# Altium schematic sheet DSD_SDR_MainBoard_Simple.SchDoc
size A4; SheetNumber: 1; SheetTotal: 1; SPICEModelCacheQBMOYUVP: <root> / <DocumentId>QBMOYUVP</DocumentId> / <CacheFrame Number="0"> / <Model Name="0603_742792651_600ohm" Kind="CKT"> / <Text>******* / .subckt 0603_742792651_600ohm 1 2 / Rp 1 2 813 / Cp 1 2 0.617p / Rs 1 N3 0.2 / L1 N3 2 1.384u / .ends 0603_742792651_600ohm</Text> / </Model> / <Model Name="0603_885012206051_680nf" Kind="CKT"> / <Text>******* / .subckt 0603_885012206051_680nF 1 2 / Rser 1 3 0.00730097281816 / Lser 2 4 4.2920775E-10 / C1 3 4 0.00000068 / Rpar 3 4 700000000 / .ends 0603_885012206051_680nF</Text> / </Model> / </CacheFrame> / </root>
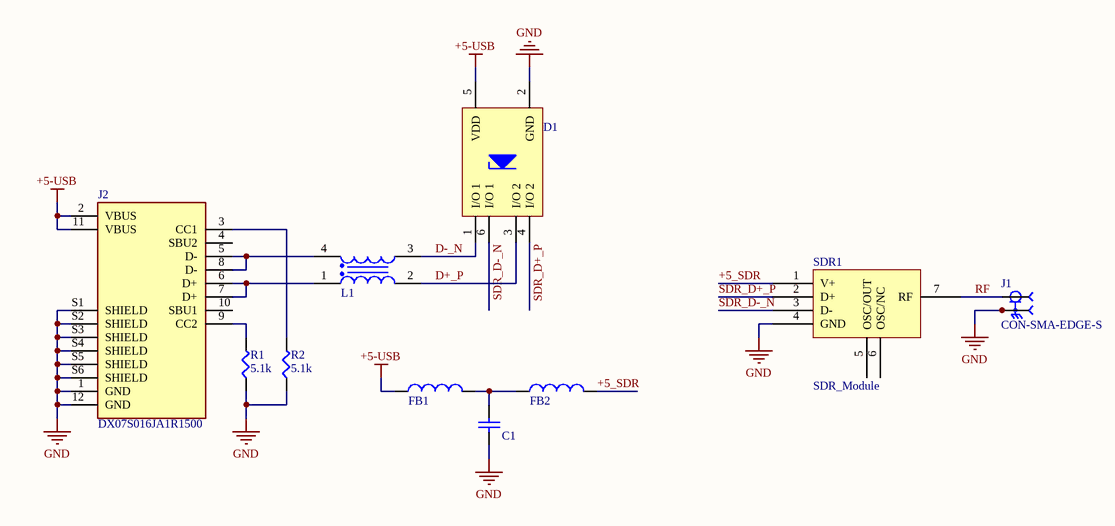
[diagram p0: DSD_SDR_MainBoard_Simple.SchDoc]

## Parts
C1  680nF  [WCAP-CSGP_0603_L1.6W0.8H0.8_Reflow]  (value not drawn)
D1  5V  [WE-TVS_SOT23-6L]  (value not drawn)
FB1  600Ohm  [WE-CBF_0603_L1.6W0.8H0.8_HC]  (value not drawn)
FB2  600Ohm  [WE-CBF_0603_L1.6W0.8H0.8_HC]  (value not drawn)
J1  CON-SMA-EDGE-S  [RFSOLUTIONS_CON-SMA-EDGE-S]
J2  DX07S016JA1R1500  [JAE_DX07S016JA1R1500]
L1  90Ohm  [WE-CNSW_1206]  (value not drawn)
R1  5.1k  [SMD-0603-RES]
R2  5.1k  [SMD-0603-RES]
SDR1  SDR_Module  [SDR]

## Nets
+5-USB: D1.5(VDD) FB1.1 J2.2(VBUS) J2.11(VBUS)
GND: C1.1 D1.2(GND) J1.G1 J1.G2 J1.G3 J1.G4 J2.1(GND) J2.12(GND) J2.S1(SHIELD) J2.S2(SHIELD) J2.S3(SHIELD) J2.S4(SHIELD) J2.S5(SHIELD) J2.S6(SHIELD) R1.1 R2.1 SDR1.4(GND)
+5_SDR: FB2.2 SDR1.1(V+)
D+_P: D1.3(I/O_2) L1.2
D-_N: D1.1(I/O_1) L1.3
RF: J1.1 SDR1.7(RF)
SDR_D+_P: D1.4(I/O_2) SDR1.2(D+)
SDR_D-_N: D1.6(I/O_1) SDR1.3(D-)
NetC1_2: C1.2 FB1.2 FB2.1
NetJ2_3: J2.3(CC1) R2.2
NetJ2_5: J2.5(D-) J2.8(D-) L1.4
NetJ2_6: J2.6(D+) J2.7(D+) L1.1
NetJ2_9: J2.9(CC2) R1.2

Not connected (* = marked no-connect by the designer): J2 4(SBU2) 10(SBU1); SDR1 5(OSC/OUT) 6(OSC/NC)

## Library data of the parts
C1 = 885012206051: WCAP-CSGP Multilayer Ceramic Chip Capacitor, General Purpose, size 0603, X7R, 680nF, 16VDC; Manufacturer: Wurth Elektronik; Case/Size Code: 0603; Capacitance Tolerance: +/-10%; Dissipation Factor: 10%; Insulation Resistance: 0.7GΩ; Rated Voltage (DC): 16V; Technical Reference: X7R0603684K016DFCT10000; Manufacturer Part Number: 885012206051; Category: Multilayer Ceramic Chip Capacitors; Match Code: WCAP-CSGP; ComponentLink1Description: Website Link; ComponentLink1URL: https://www.we-online.com/redexpert/article/885012206051?ad; ComponentLink2Description: Datasheet Link; ComponentLink2URL: https://www.we-online.com/redexpert/spec/885012206051?ad; Mount: Surface Mount; Operating Temperature Max: 125°C; Operating Temperature Min: -55°C; Packaging: Tape and Reel; Length: 1.6mm; Width: 0.8mm; Height: 0.8mm; Capacitance: 680nF; Ceramic Type: X7R
D1 = 82400102: WE-TVS TVS Diode – High Speed Series, SOT23-6L, 2+1 Channel, 5V, 2pF; Manufacturer: Wurth Elektronik; Channel ESD Clamping Voltage: 10V; Channel Reverse Leakage Current: 1µA; ESD Air Discharge Capability: 15kV; ESD Contact Discharge Capability: 8kV; Polarity: Unidirectional; (Reverse) Breakdown Voltage: 6V; (Reverse) Peak Pulse Current: 7A; ComponentLink1Description: Website Link; ComponentLink1URL: https://www.we-online.com/redexpert/article/82400102?ad; ComponentLink2Description: Datasheet Link; ComponentLink2URL: https://www.we-online.com/redexpert/spec/82400102?ad; Manufacturer Part Number: 82400102; Category: ESD Protection; Match Code: WE-TVS; Mount: Surface Mount; Operating Temperature Max: 125°C; Operating Temperature Min: -40°C; Packaging: Tape and Reel; Case/Size Code: SOT23-6L; Length: 2.9mm; Width: 2.8mm; Height: 1.45mm; Channel Input Capacitance: 2pF; Channel Operating Voltage: 5V; Number of Channels: 2+1
FB1 FB2 = 742792651: WE-CBF SMT EMI Suppression Ferrite Bead, size 0603, 600Ohm, 1A; Manufacturer: Wurth Elektronik; Case/Size Code: 0603; DC Resistance Max: 0.2Ohm; Impedance Max: 800Ohm; Impedance Max Test Condition: 200MHz; Type: High Current; Manufacturer Part Number: 742792651; Category: Ferrites for PCB Assembly; Match Code: WE-CBF; ComponentLink1Description: Website Link; ComponentLink1URL: https://www.we-online.com/redexpert/article/742792651?ad; ComponentLink2Description: Datasheet Link; ComponentLink2URL: https://www.we-online.com/redexpert/spec/742792651?ad; Mount: Surface Mount; Operating Temperature Max: 125°C; Operating Temperature Min: -55°C; Packaging: Tape and Reel; Length: 1.6mm; Width: 0.8mm; Height: 0.8mm; Impedance @100MHz: 600Ohm; Rated Current: 1A
J1 = CON-SMA-EDGE-S: SMA Connector Jack, Female Socket - Board Edge, End Launch Solder; MF: RF Solutions; Value: *; SnapEDA_Link: https://www.snapeda.com/parts/CON-SMA-EDGE-S/RF+Solutions/view-part/?ref=snap; Purchase-URL: https://pricing.snapeda.com/search/part/CON-SMA-EDGE-S/?ref=eda; Check_prices: https://www.snapeda.com/parts/CON-SMA-EDGE-S/RF+Solutions/view-part/?ref=eda; Digi-Key_Part_Number: CON-SMA-EDGE-S-ND; Package: None; MP: CON-SMA-EDGE-S
J2 = DX07S016JA1R1500: USB-C (USB TYPE-C) USB 2.0 Receptacle Connector 24 (16+8 Dummy) Position Surface Mount, Right Angle; Through Hole; MF: JAE Electronics; Value: *; Price: None; Package: None; Availability: Unavailable; MP: DX07S016JA1R1500; DigiKey-Purchase-URL: https://snapeda.com/shop?store=DigiKey&id=4551013; SnapEDA_Link: https://www.snapeda.com/parts/DX07S016JA1R1500/JAE%20Electronics/view-part/4551013/?ref=snap
L1 = 744232090: WE-CNSW SMT Common Mode Line Filter, size 1206, 90Ohm, 0.111uH, 50V; Manufacturer: Wurth Elektronik; Case/Size Code: 1206; DC Resistance Max: 0.3Ohm; Insulation Test Voltage: 125VAC; Rated Current: 0.37A; Winding Style: bifiliar; ComponentLink1Description: Manufacturer Link; ComponentLink1URL: https://www.we-online.com/redexpert/article/744232090?ad; ComponentLink2Description: Datasheet; ComponentLink2URL: https://www.we-online.com/redexpert/spec/744232090?ad; Category: Common Mode Chokes; Match Code: WE-CNSW; Manufacturer Part Number: 744232090; Mount: Surface Mount; Operating Temperature Max: 125°C; Operating Temperature Min: -40°C; Packaging: Tape and Reel; Length: 3.2mm; Width: 1.6mm; Height: 1.8mm; Impedance @100MHz: 90Ohm; Inductance: 0.111uH; Rated Voltage: 50V
R1 R2 = ERJ-3EKF5101V: RES SMD 5.1K OHM 1% 1/10W 0603; Manufacturer: Panasonic Electronic Components; Factory Stock: 0; Unit Price (USD): 0.00379; @ qty: 1500; Minimum Quantity: 1; Power (Watts): 0.1W, 1/10W; Temperature Coefficient: ±100ppm/°C; Part Number: ERJ-3EKF5101V; Datasheets: http://industrial.panasonic.com/www-cgi/jvcr13pz.cgi?E+PZ+3+AOA0002+ERJ3EKF5101V+7+WW; Image: //media.digikey.com/Photos/Panasonic%20Photos/MFG_ERJ-P6W%20Series.jpg; Digi-Key Part Number: P5.10KHCT-ND; Quantity Available: 159646; Packaging: Cut Tape (CT); Series: ERJ; Part Status: Active; Value: 5.1k; Tolerance: ±1%; Composition: Thick Film; Features: Automotive AEC-Q200; Operating Temperature: -55°C ~ 155°C; Package / Case: 0603 (1608 Metric); Supplier Device Package: 0603; Size / Dimension: 0.063" L x 0.031" W (1.60mm x 0.80mm); Height - Seated (Max): 0.022" (0.55mm); Number of Terminations: 2; Failure Rate: -